# Altium schematic sheet [02] - BLOCK DIAGRAM.SchDoc: BLOCK DIAGRAM
size A3; Author: Gabriel Piñango; DocumentNumber: 2; Revision: V1I1; SheetNumber: 2; SheetTotal: 6; Collaborator: Gabriel Pinango; Project: MultiTestcard; VersionRevision: V1I1; Designer: Gabriel Pinango
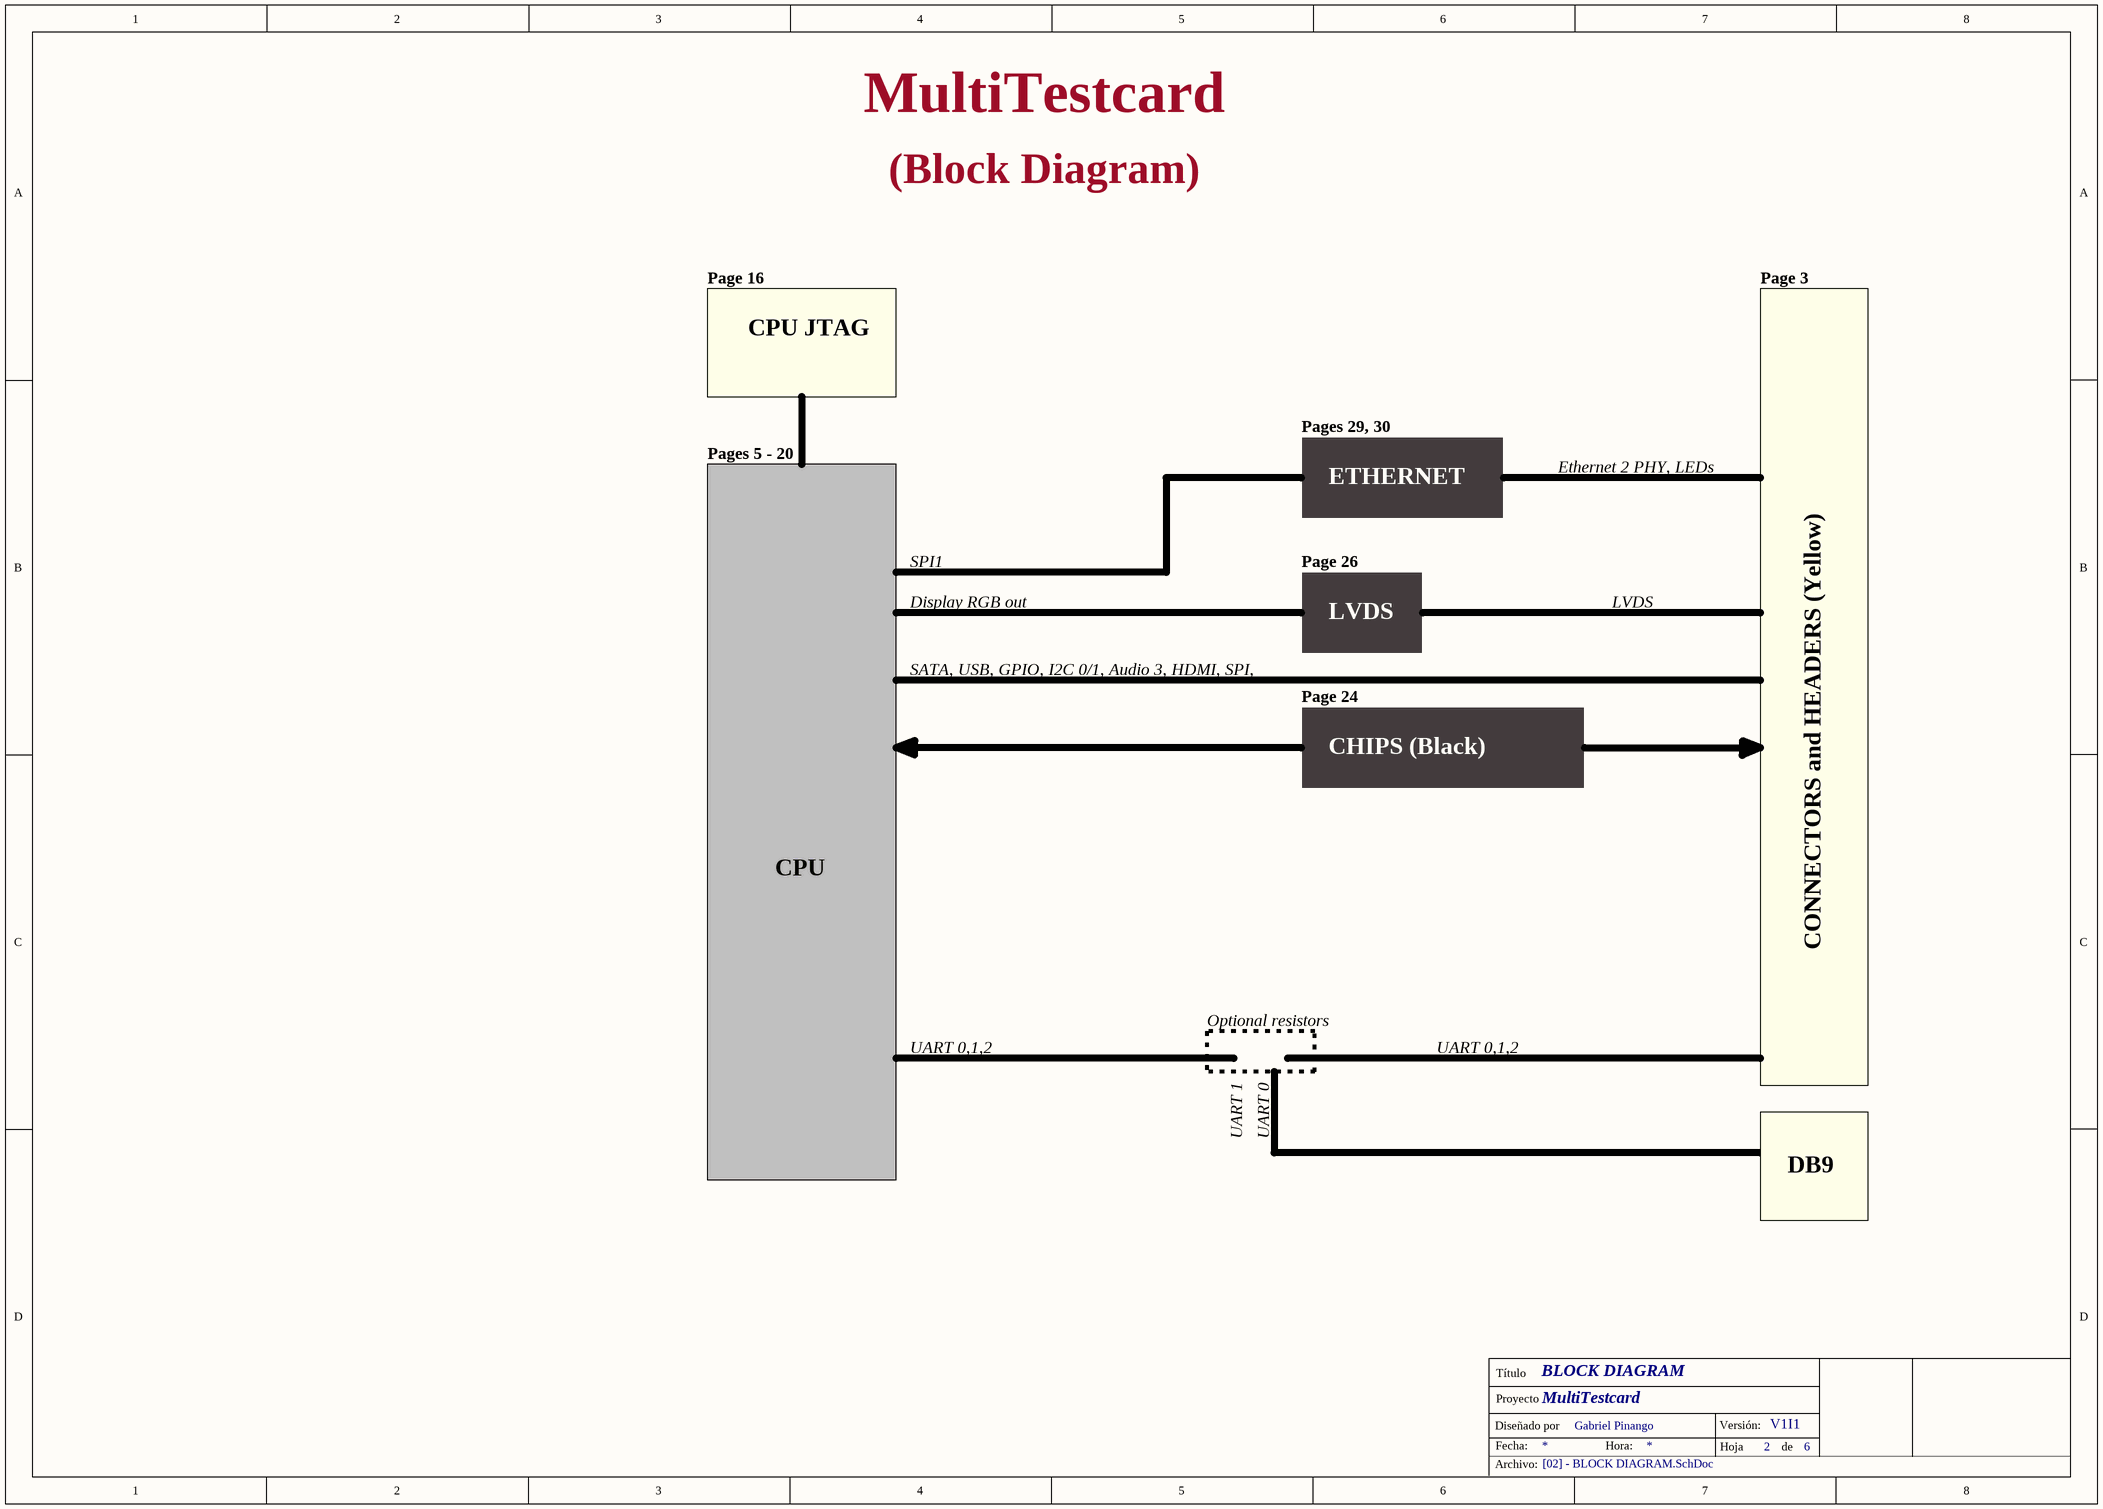
[diagram p0: [02] - BLOCK DIAGRAM.SchDoc]

## Notes on the sheet
- (Block Diagram)
- Page 16
- Page 3
- CPU JTAG
- Pages 29, 30
- Pages 5 - 20
- ETHERNET
- Ethernet 2 PHY, LEDs
- SPI1
- Page 26
- Display RGB out
- LVDS
- SATA, USB, GPIO, I2C 0/1, Audio 3, HDMI, SPI,
- Page 24
- CHIPS (Black)
- CPU
- CONNECTORS and HEADERS (Yellow)
- UART 0,1,2
- Optional resistors
- FPGA
- UART 1
- UART 0
- DB9
- CLOCKS (CPU & PCIE)
- Título
- Diseñado por
- Fecha:
- Proyecto
- Hora:
- Versión:
- Hoja
- de
- Archivo: